# EasyEDA Pro project New Project_2026-09-05_09-11-29.eprj, board PCB1
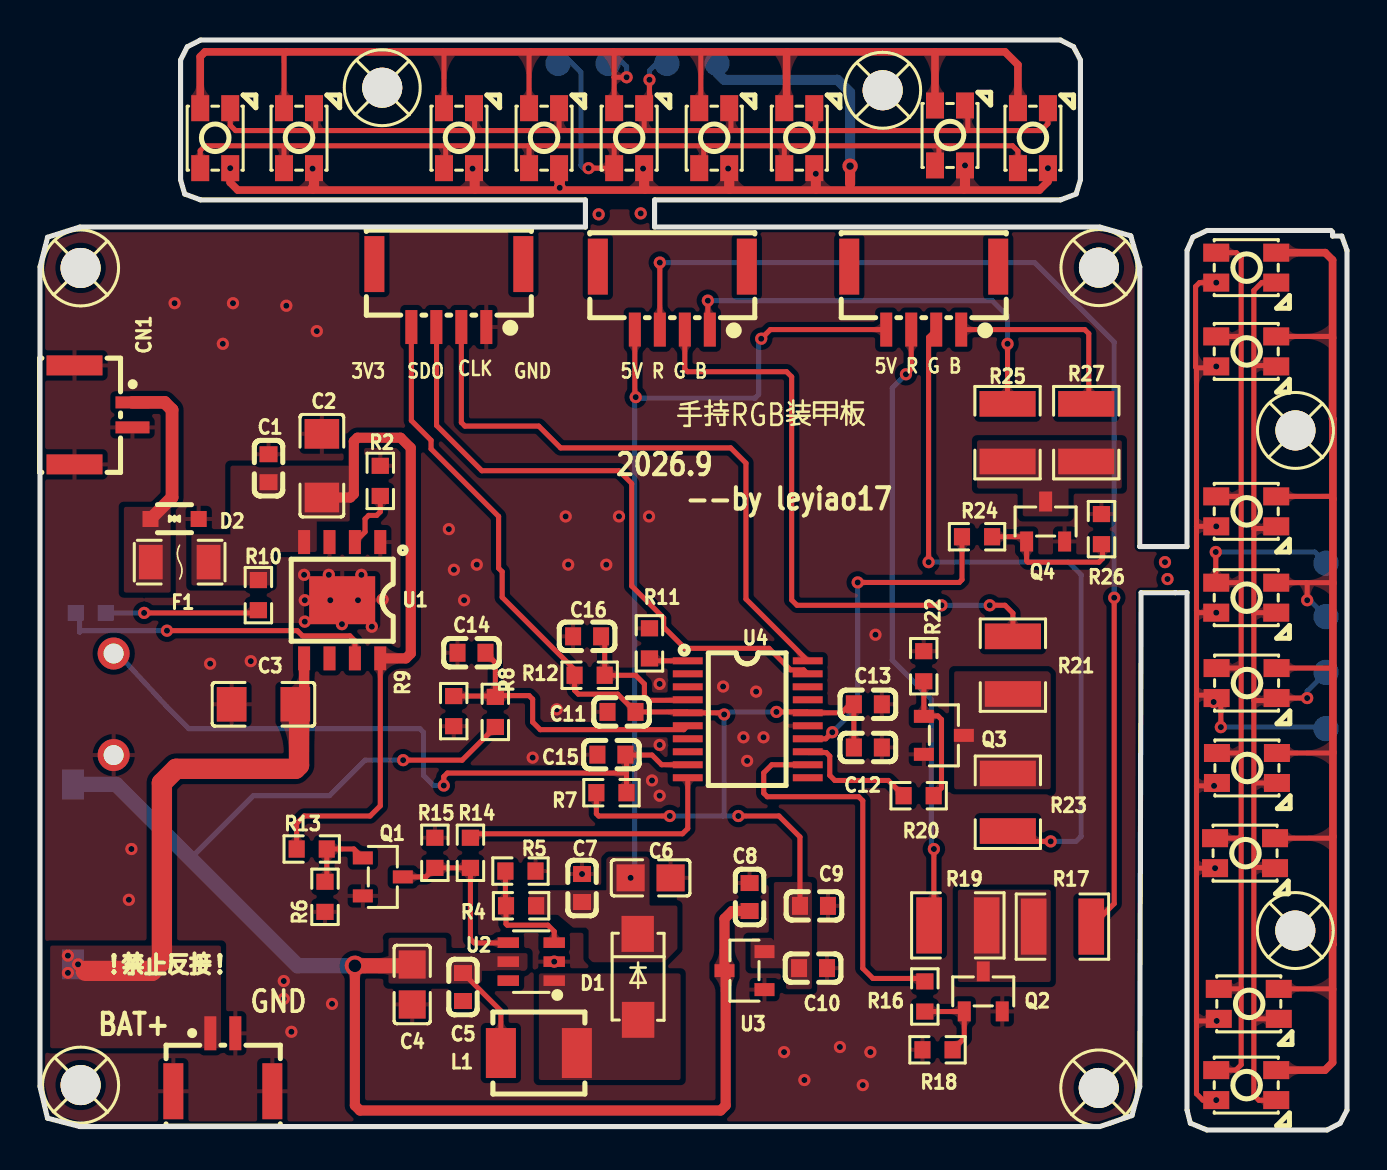
[diagram p4: board, top side]
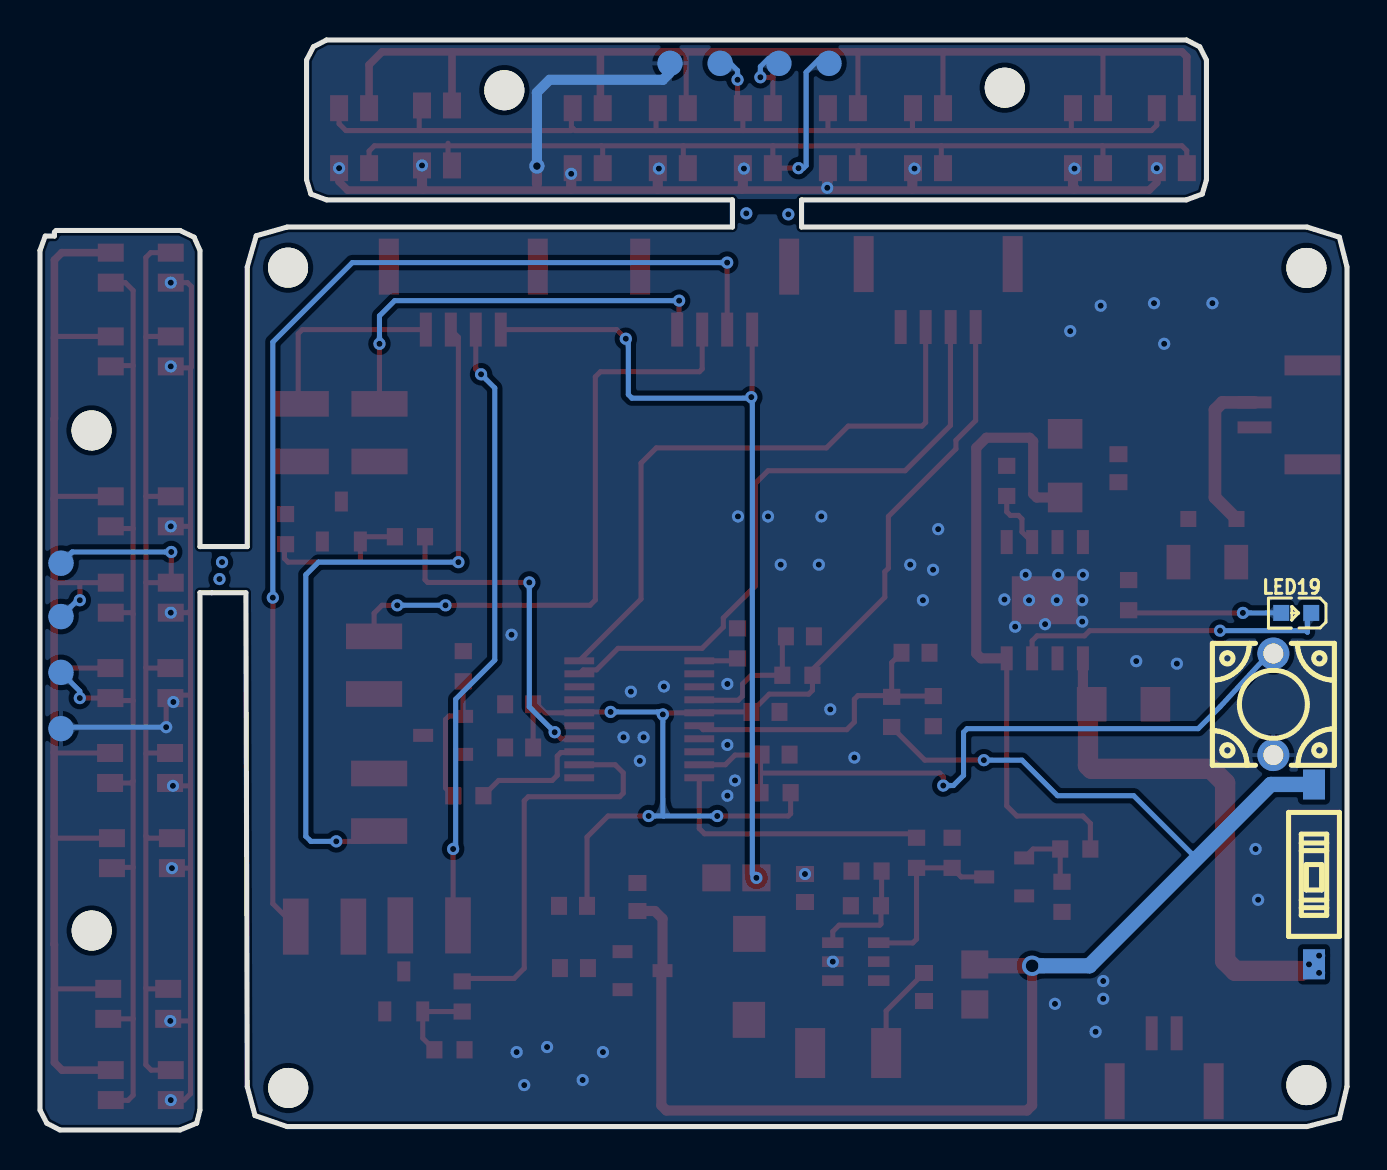
[diagram p5: board, bottom side, seen from below]

Outline 65.36 x 54.53 mm; copper layers: Top Layer, Bottom Layer. Coordinates in mm from the lower left corner of the outline.
Outline path: 0,43.17 0.38,44.67 2,45.17 27.28,45.17 27.28,46.53 8.03,46.53 7.24,46.82 7.03,47.53 7.03,53.53 7.37,54.19 8.03,54.53 51.03,54.53 51.69,54.19 52.03,53.53 52.03,47.53 51.82,46.82 51.03,46.53 30.74,46.53 30.74,45.17 53,45.17 54.55,44.73 55,43.17 55,29.19 57.36,29.19 57.36,44 57.66,44.67 58.36,45 64.56,45 64.64,44.92 64.64,44.72 65.1,44.72 65.36,44 65.36,1 65.02,0.34 64.36,0 58.36,0 57.53,0.34 57.36,1 57.36,26.88 56.77,26.88 55.07,26.88 55,2.17 54.61,0.72 53,0.17 2,0.17 0.38,0.59 0,2.17 0,43.17
Stack: Top Layer 0.035mm / Dielectric1 1.51mm FR4 er 4.5 / Bottom Layer 0.035mm

## Design rules (mm)
template: 自定义配置
spacing copperThickness1oz (default): track to track 0.102, other pairs 0.152 to 0.3
spacing copperThickness2oz: track to track 0.203, other pairs 0.152 to 0.3
track width copperThickness1oz (default): min 0.127, default 0.254, max 2.54
track width copperThickness2oz: min 0.203, default 0.254, max 2.54
differential pair differentialPair (default): width min 0.127, default 0.254, max 2.54; gap min 0.152, default 0.152
via viaSize (default): diameter min 0.5, default 0.61, max 10; hole min 0.3, default 0.305, max 6.3
net USB_5V uses copperRegion1
net BAT+ uses copperRegion1
net +5V uses copperRegion1
net $1N3575 uses copperRegion1
net USB_VBUS uses copperRegion1
net $1N6844 uses copperRegion1
net $1N6957 uses copperRegion1
net $1N6996 uses copperRegion1
net SYS_BAT uses copperRegion1
net 3V3 uses copperRegion1

## Placement (name value [footprint] x y rotation side)
C1  100nF  [C0603]  11.43 33.11 270 top
C2  10uF  [C1206]  14.1 33.23 270 top
C3  10uF  [C1206]  11.18 21.3 0 top
C4  22uF  [C0805]  18.61 7.28 90 top
C5  100nF  [C0603]  21.15 7.15 90 top
C6  22uF  [C0805]  30.54 12.61 180 top
C7  100nF  [C0603]  27.11 12.11 270 top
C8  1uF  [C0603]  35.49 11.66 270 top
C9  1uF  [C0603]  38.71 11.21 180 top
C10  100nF  [C0603]  38.66 8.1 180 top
C11  100nF  [C0603]  29.08 20.92 0 top
C12  100nF  [C0603]  41.4 19.14 180 top
C13  1uF  [C0603]  41.4 21.3 180 top
C14  100nF  [C0603]  21.58 23.88 0 top
C15  100nF  [C0603]  28.58 18.78 0 top
C16  100nF  [C0603]  27.36 24.7 0 top
CN1  WAFER-GH1.25-2PWB  [CONN-TH_2P-P1.25_XUNPU_WAFER-GH1.25-2PWB]  3.17 35.78 270 top
CN2  WAFER-GH1.25-2PWB  [CONN-TH_2P-P1.25_XUNPU_WAFER-GH1.25-2PWB]  9.14 3.39 0 top
D1  SS34  [SMA_L4.3-W2.6-LS5.0-FD]  29.9 7.66 90 top
D2  PESD5V0S1BA,115  [SOD-323_L1.7-W1.3-LS2.5-BI]  6.73 30.57 0 top
F1  BSMD1206-200-6V  [F1206]  6.98 28.41 0 top
L1  4.7uH  [IND-SMD_L4.6-W4.1-A]  24.95 3.85 0 top
LED1  S4-3528RGBTA-A  [LED-SMD_4P-L3.2-W2.8-LS3.5-TL-1]  8.76 49.62 90 top
LED2  S4-3528RGBTA-A  [LED-SMD_4P-L3.2-W2.8-LS3.5-TL-1]  45.51 49.75 90 top
LED3  S4-3528RGBTA-A  [LED-SMD_4P-L3.2-W2.8-LS3.5-TL-1]  12.95 49.62 90 top
LED4  S4-3528RGBTA-A  [LED-SMD_4P-L3.2-W2.8-LS3.5-TL-1]  33.72 49.62 90 top
LED5  S4-3528RGBTA-A  [LED-SMD_4P-L3.2-W2.8-LS3.5-TL-1]  25.21 49.62 90 top
LED6  S4-3528RGBTA-A  [LED-SMD_4P-L3.2-W2.8-LS3.5-TL-1]  20.96 49.62 90 top
LED7  S4-3528RGBTA-A  [LED-SMD_4P-L3.2-W2.8-LS3.5-TL-1]  37.97 49.62 90 top
LED8  S4-3528RGBTA-A  [LED-SMD_4P-L3.2-W2.8-LS3.5-TL-1]  29.46 49.62 90 top
LED9  S4-3528RGBTA-A  [LED-SMD_4P-L3.2-W2.8-LS3.5-TL-1]  49.66 49.62 90 top
LED10  S4-3528RGBTA-A  [LED-SMD_4P-L3.2-W2.8-LS3.5-TL-1]  60.32 2.25 0 top
LED11  S4-3528RGBTA-A  [LED-SMD_4P-L3.2-W2.8-LS3.5-TL-1]  60.45 6.31 0 top
LED12  S4-3528RGBTA-A  [LED-SMD_4P-L3.2-W2.8-LS3.5-TL-1]  60.32 26.63 0 top
LED13  S4-3528RGBTA-A  [LED-SMD_4P-L3.2-W2.8-LS3.5-TL-1]  60.36 18.11 0 top
LED14  S4-3528RGBTA-A  [LED-SMD_4P-L3.2-W2.8-LS3.5-TL-1]  60.32 38.95 0 top
LED15  S4-3528RGBTA-A  [LED-SMD_4P-L3.2-W2.8-LS3.5-TL-1]  60.32 30.95 0 top
LED16  S4-3528RGBTA-A  [LED-SMD_4P-L3.2-W2.8-LS3.5-TL-1]  60.27 13.85 0 top
LED17  S4-3528RGBTA-A  [LED-SMD_4P-L3.2-W2.8-LS3.5-TL-1]  60.34 22.36 0 top
LED18  S4-3528RGBTA-A  [LED-SMD_4P-L3.2-W2.8-LS3.5-TL-1]  60.32 43.14 0 top
LED19  LTST-C190KSKT  [LED0603-RD]  2.54 25.87 0 bottom
Q1  MMBT3904  [SOT-23-3_L2.9-W1.3-P1.90-LS2.4-BR]  17.15 12.66 180 top
Q2  AO3400A  [SOT-23-3_L2.9-W1.3-P1.90-LS2.4-BR]  47.17 6.93 270 top
Q3  AO3400A  [SOT-23-3_L2.9-W1.3-P1.90-LS2.4-BR]  45.2 19.74 180 top
Q4  AO3400A  [SOT-23-3_L2.9-W1.3-P1.90-LS2.4-BR]  50.29 30.44 270 top
R2  4.7kΩ  [R0603]  17.02 32.47 270 top
R4  110kΩ  [R0603]  24.06 11.22 0 top
R5  15kΩ  [R0603]  24.03 12.95 180 top
R6  100kΩ  [R0603]  14.25 11.67 90 top
R7  10K  [R0603]  28.58 16.88 180 top
R8  100kΩ  [R0603]  22.77 20.92 270 top
R9  100kΩ  [R0603]  20.69 20.95 270 top
R10  2.4kΩ  [R0603]  10.92 26.76 90 top
R11  10kΩ  [R0603]  30.48 24.34 270 top
R12  10K  [R0603]  27.49 22.75 180 top
R13  10kΩ  [R0603]  13.59 14.06 0 top
R14  10kΩ  [R0603]  21.53 13.87 270 top
R15  100kΩ  [R0603]  19.75 13.87 270 top
R16  100Ω  [R0603]  44.25 6.68 270 top
R17  68Ω  [R1210]  51.13 10.18 0 top
R18  100kΩ  [R0603]  44.89 4.01 0 top
R19  68Ω  [R1210]  45.9 10.24 180 top
R20  100Ω  [R0603]  43.94 16.73 0 top
R21  47Ω  [R1210]  48.66 23.25 90 top
R22  100kΩ  [R0603]  44.2 23.2 270 top
R23  47Ω  [R1210]  48.4 16.4 270 top
R24  100Ω  [R0603]  46.86 29.68 0 top
R25  47Ω  [R1210]  48.39 34.89 90 top
R26  100kΩ  [R0603]  53.09 30.06 270 top
R27  47Ω  [R1210]  52.32 34.89 90 top
SCREW1  -  [M2螺丝]  62.78 9.98 0 top
SCREW2  -  [M2螺丝]  62.79 35 0 top
SCREW3  -  [M2螺丝]  17.12 52.14 0 top
SCREW4  -  [M2螺丝]  42.14 52.02 0 top
SCREW5  -  [M2螺丝]  52.96 43.14 0 top
SCREW6  -  [M2螺丝]  52.95 2.1 0 top
SCREW7  -  [M2螺丝]  2.03 43.13 0 top
SCREW8  -  [M2螺丝]  2.03 2.25 0 top
SW1  TSX06121-095B333DA-L2000  [SW-TH_L6.1-W6.1-P5.00]  3.68 21.3 90 bottom
SW2  DSIC01LS-P  [SW-SMD_2P-L3.5-W6.1-P2.54-LS9.8]  1.65 12.79 270 bottom
TP1  -  [Test-Point-0.5mm]  25.91 53.36 180 bottom
TP2  -  [Test-Point-0.5mm]  31.35 53.36 180 bottom
TP3  -  [Test-Point-0.5mm]  28.41 53.36 180 bottom
TP4  -  [Test-Point-0.5mm]  33.86 53.36 180 bottom
TP5  -  [Test-Point-0.5mm]  64.32 28.36 90 bottom
TP6  -  [Test-Point-0.5mm]  64.32 22.89 270 bottom
TP7  -  [Test-Point-0.5mm]  64.32 25.68 270 bottom
TP8  -  [Test-Point-0.5mm]  64.32 20.08 270 bottom
U1  TP4056  [ESOP-8_L4.9-W3.9-P1.27-LS6.0-BL-EP]  15.11 26.5 180 top
U2  MT3608  [SOT-23-6_L2.9-W1.6-P0.95-LS2.8-BL]  24.57 8.42 90 top
U3  XC6206P332MR  [SOT-23-3_L2.9-W1.3-P1.90-LS2.4-BR]  35.23 7.97 0 top
U4  STM32F030F4P6TR  [SOP-20_L6.5-W4.4-P0.65-LS6.4-BL]  35.4 20.55 270 top
U5  WAFER-GH1.25-4PWB  [CONN-SMD_4P-P1.25_XUNPU_WAFER-GH1.25-4PWB]  31.62 41.62 180 top
U6  WAFER-GH1.25-4PWB  [CONN-SMD_4P-P1.25_XUNPU_WAFER-GH1.25-4PWB]  44.2 41.62 180 top
U7  WAFER-GH1.25-4PWB  [CONN-SMD_4P-P1.25_XUNPU_WAFER-GH1.25-4PWB]  20.45 41.74 180 top

## Footprints (pads in the part's own frame, mm; a bottom-side part is the same pattern mirrored in y, then rotated)
C0603
  rect 0.8x0.9 smd: 1(-0.7,0) 2(0.7,0)
C0805
  rect 1.41x1.35 smd: 1(-1,0) 2(1,0)
C1206
  rect 1.485x1.728 smd: 1(-1.593,0) 2(1.593,0)
CONN-SMD_4P-P1.25_XUNPU_WAFER-GH1.25-4PWB
  rect 0.6x1.7 smd: 1(-1.875,1.575) 2(-0.625,1.575) 3(0.625,1.575) 4(1.875,1.575)
  rect 1x2.8 smd: 5(3.725,-1.575) 6(-3.725,-1.575)
CONN-TH_2P-P1.25_XUNPU_WAFER-GH1.25-2PWB
  rect 0.6x1.7 smd: 1(-0.625,1.45) 2(0.625,1.45)
  rect 1x2.8 smd: 3(-2.475,-1.45) 4(2.475,-1.45)
ESOP-8_L4.9-W3.9-P1.27-LS6.0-BL-EP
  rect 0.6x1.2 smd: 1(-1.905,-2.909) 2(-0.635,-2.909) 3(0.635,-2.909) 4(1.905,-2.909) 5(1.905,2.909) 6(0.635,2.909) 7(-0.635,2.909) 8(-1.905,2.909)
  rect 3.3x2.4 smd: 9(0,0)
F1206
  rect 1.19x1.728 smd: 1(-1.445,0) 2(1.445,0)
IND-SMD_L4.6-W4.1-A
  rect 1.5x2.5 smd: 1(-1.9,0) 2(1.9,0)
LED0603-RD
  rect 0.8x0.8 smd: 1(-0.749,0) 2(0.749,0)
LED-SMD_4P-L3.2-W2.8-LS3.5-TL-1
  rect 1.3x0.9 smd: 1(-1.5,0.75) 2(-1.5,-0.75) 3(1.5,0.75) 4(1.5,-0.75)
M2螺丝
  round 2 hole 2: 1(0,0)
R0603
  rect 0.806x0.864 smd: 1(-0.753,0) 2(0.753,0)
R1210
  rect 1.282x2.808 smd: 1(-1.441,0) 2(1.441,0)
SMA_L4.3-W2.6-LS5.0-FD
  rect 1.8x1.62 smd: 1(-2.15,-0.009) 2(2.15,0.009)
SOD-323_L1.7-W1.3-LS2.5-BI
  rect 0.8x0.8 smd: 1(-1.205,0) 2(1.205,0)
SOP-20_L6.5-W4.4-P0.65-LS6.4-BL
  rect 0.35x1.494 smd: 1(-2.925,-3.001) 2(-2.275,-3.001) 3(-1.625,-3.001) 4(-0.975,-3.001) 5(-0.325,-3.001) 6(0.324,-3.001) 7(0.975,-3.001) 8(1.625,-3.001) 9(2.275,-3.001) 10(2.925,-3.001) 11(2.925,3.001) 12(2.275,3.001) 13(1.625,3.001) 14(0.975,3.001) 15(0.325,3.001) 16(-0.325,3.001) 17(-0.975,3.001) 18(-1.625,2.996) 19(-2.275,2.996) 20(-2.925,3.001)
SOT-23-3_L2.9-W1.3-P1.90-LS2.4-BR
  rect 1x0.65 smd: 1(1,-0.95) 2(1,0.95) 3(-1,0)
SOT-23-6_L2.9-W1.6-P0.95-LS2.8-BL
  rect 0.532x1.072 smd: 1(-0.95,-1.149) 2(0,-1.149) 3(0.95,-1.149) 4(0.95,1.149) 5(0,1.149) 6(-0.95,1.149)
SW-SMD_2P-L3.5-W6.1-P2.54-LS9.8
  rect 1.5x1.1 smd: 1(-4.5,0) 2(4.5,0)
SW-TH_L6.1-W6.1-P5.00
  round 1.6 hole 1: 1(-2.54,0) 2(2.54,0)
Test-Point-0.5mm
  round 1.27 smd: 1(0,0)

## Nets
As in the schematic.

Pads without a net: C5 1; SCREW1 1; SCREW2 1; SCREW3 1; SCREW4 1; SCREW5 1; SCREW6 1; SCREW7 1; SCREW8 1; U2 6; U4 2 3 7 8 11 17 18; U5 5 6; U6 5 6; U7 5 6

## Via types
v1: diameter 0.61, hole 0.305, Top Layer to Bottom Layer, 106 vias
v2: diameter 1.016, hole 0.635, Top Layer to Bottom Layer, 1 via
v3: diameter 0.762, hole 0.381, Top Layer to Bottom Layer, 1 via

## Routing (per net, layer and track width the routed paths; a pad name or vN(x,y) marks a point on that pad's centre or on a via; arc(x,y) is an arc through that point)
3V3: length 58.5
  Top Layer w0.254: C9.2 38.01,14.66 36.96,15.71 v1(34.93,15.71) ; v1(34.22,20.79) 34.22,20.81 34.16,20.87 U4.5 32.35,20.92 C11.2 28.89,21.81 26.92,21.81 26.73,22 26.73,22.5 ; U7.4 18.57,35.49 19.56,34.5 19.56,34.07 22.94,30.69 22.94,28.11 23.11,27.93 23.11,26.65 26.73,23.03 R12.2 ; v1(36.83,20.92) 38.35,20.92 U4.16 40.09,20.87 40.51,21.3 C13.2 C12.2 ; R7.2 27.82,15.82 27.94,15.71 v1(31.5,15.71)
  Bottom Layer w0.254: v1(31.5,15.71) 34.16,15.71 ; 34.16,15.71 v1(34.93,15.71) ; 34.16,15.71 34.22,15.76 v1(34.22,20.79) 34.34,20.92 v1(36.83,20.92)
+5V: length 43.2
  Top Layer w0.254: v1(36.07,39.59) 36.53,40.04 U6.4 ; v1(29.79,36.66) 29.75,36.71 U5.4
  Bottom Layer w0.254: 29.74,36.61 35.76,36.61 35.94,36.79 35.94,39.46 v1(36.07,39.59) ; 29.74,36.61 29.72,36.61 29.77,36.66 v1(29.79,36.66) 29.74,36.61 ; 29.74,36.61 29.74,12.82 v1(29.54,12.61)
GND:
  vias: v1(4.44,11.52) v1(4.57,14.06) v1(6.73,41.36) v1(8.51,23.33) v1(9.14,39.33) v1(9.65,41.36) v1(10.54,23.46) v1(12.19,7.45) v1(12.19,6.56) v1(12.32,41.24) v1(12.57,4.91) v1(13.21,27.77) v1(13.24,26.5) v1(13.24,25.43) v1(13.84,39.97) v1(14.44,27.77) v1(14.52,26.5) v1(14.6,6.31) v1(15.1,25.31) v1(15.9,26.5) v1(16.07,27.77) v1(16.6,25.18) v1(17.13,26.54) v1(20.45,30.06) v1(20.7,28.03) v1(21.21,26.5) v1(21.84,28.28) v1(24.64,18.63) v1(25.72,8.42) v1(25.84,21.04) v1(26.29,30.7) v1(26.42,28.28) v1(27.11,12.81) v1(28.32,28.28) v1(28.96,30.7) v1(30.46,30.7) v1(30.61,17.49) v1(30.99,22.32) v1(30.99,19.27) v1(30.99,16.73) v1(34.16,22.19) v1(35.18,19.65) v1(35.36,18.47) v1(35.81,21.93) v1(36.18,19.65) v1(37.21,3.9) v1(38.23,2.5) v1(40,4.15) v1(41.15,2.25) v1(41.53,3.9) v1(41.78,24.78)
(no net):
  vias: v1(27.94,45.81) v1(30.04,45.86) v1(56.26,28.41) v1(56.39,27.56)
B1: length 59.1
  Top Layer w0.254: 60.07,39.67 60.04,39.7 LED14.1 ; 60.07,39.67 60.07,31.71 ; 60.07,39.67 60.07,43.65 59.83,43.89 LED18.1 ; 60.07,31.71 60.07,27.39 ; 60.07,31.71 60.06,31.7 LED15.1 ; 60.07,27.39 60.07,23.14 ; 60.07,27.39 60.06,27.38 LED12.1 58.8,27.41 v1(58.8,28.92) ; 60.07,7.1 60.03,7.06 LED11.1 ; 60.07,7.1 60.07,14.72 ; 60.07,7.1 60.07,3.26 59.81,3 LED10.1 ; 60.07,18.83 60.07,14.72 ; 60.07,18.83 60.07,23.14 ; 60.07,18.83 60.04,18.86 LED13.1 ; 60.07,14.72 59.96,14.6 LED16.1 ; LED17.1 60.04,23.11 60.07,23.14
  Bottom Layer w0.254: v1(58.8,28.92) 63.75,28.92 TP5.1
B2: length 58.7
  Top Layer w0.254: LED3.1 12.2,49.2 12.24,49.24 ; 44.76,48.25 44.96,48.45 44.96,49.24 ; 33.19,49.24 33.19,48.34 LED4.1 ; 33.19,49.24 28.7,49.24 ; 33.19,49.24 37.29,49.24 ; LED6.1 20.29,48.2 20.29,49.24 ; 12.24,49.24 8.25,49.24 8.01,49 LED1.1 ; 12.24,49.24 20.29,49.24 ; 44.96,49.24 44.96,49.36 ; 44.96,49.24 48.64,49.24 48.91,48.97 LED9.1 ; 44.96,49.24 37.29,49.24 ; 24.43,49.24 28.7,49.24 ; 24.43,49.24 24.46,49.21 LED5.1 ; 24.43,49.24 20.29,49.24 ; 28.7,49.24 28.71,49.23 LED8.1 v1(27.43,48.12) ; LED7.1 37.22,49.17 37.29,49.24
  Bottom Layer w0.254: 25.91,53.56 26.42,53.56 27.05,52.92 27.05,48.25 27.18,48.12 v1(27.43,48.12)
B_A: length 21.2
  Top Layer w0.254: U5.1 33.4,40.14 v1(33.4,41.49) ; R25.2 v1(48.39,39.33)
  Bottom Layer w0.254: v1(33.4,41.49) 47.62,41.49 48.39,40.73 v1(48.39,39.33)
B_B: length 10
  Top Layer w0.254: R27.2 52.45,36.45 52.45,39.84 52.25,40.04 U6.1
BAT+: length 25.7
  Top Layer w0.508: C3.2 13.21,21.74 U1.5
  Top Layer w1.016: 2.29,7.96 5.59,7.96 6.1,8.47 6.1,17.36 6.81,18.07 12.77,18.07 12.95,18.25 12.95,21.11 C3.2
  vias: v1(1.4,8.72) v1(1.4,7.86) v1(1.9,8.29)
BAT_ADC: length 15.6
  Top Layer w0.254: R9.1 22.73,21.71 R8.1 ; R8.1 22.77,23.38 C14.2 ; R8.1 22.83,21.73 24.46,21.73 24.64,21.55 24.64,20.41 25.02,20.03 32.2,20.03 U4.6
BLUE_PWM: length 16.8
  Top Layer w0.254: U4.14 39.3,19.57 v1(39.62,19.9) ; R24.1 46.11,27.53 45.97,27.39 v1(40.89,27.39)
  Bottom Layer w0.254: v1(39.62,19.9) 40.89,21.17 v1(40.89,27.39)
BOOST_CMD: length 13.6
  Top Layer w0.254: R14.1 21.73,14.82 32.13,14.82 32.39,15.08 U4.10
BOOST_EN: length 9.1
  Top Layer w0.254: Q1.3 19.3,12.66 R15.2 R14.2 21.53,9.55 21.72,9.36 23.4,9.36 U2.4
CHRG_N: length 15.9
  Top Layer w0.254: v1(6.35,24.98) 12.87,24.98 13.13,24.72 15.5,24.72 15.75,24.47 U1.7
  Bottom Layer w0.254: LED19.1 1.98,25.68 1.98,24.91 2.05,24.98 v1(6.35,24.98)
COM2+: length 62.5
  Top Layer w0.381: v1(50.41,48.12) 50.41,47.45 49.98,47.02 9.89,47.02 9.51,47.4 v1(9.51,48.12)
  Top Layer w0.508: LED5.2 25.99,48.09 25.99,47.47 ; LED8.2 30.21,47.14 30.27,47.08 ; v1(46.26,48.25) 46.26,47.14 46.21,47.08 ; LED4.2 34.47,47.1 34.48,47.08 ; LED3.2 13.7,47.19 13.66,47.15 13.66,47.08 ; 38.8,47.08 38.8,48.04 LED7.2 ; 21.74,47.08 21.74,48.08 LED6.2 ; 25.99,47.47 25.96,47.5 ; 25.99,47.47 v1(25.99,47.14) ; v3(40.51,48.22) 40.51,47.33
  Bottom Layer w0.508: v3(40.51,48.22) 40.51,51.9 39.88,52.54 34.22,52.54 33.91,52.84 33.91,53.69
  vias: v1(13.63,48.1) v1(21.63,48.1) v1(30.16,48.1) v1(34.41,48.1) v1(38.8,47.84)
COM+: length 56.8
  Top Layer w0.254: v1(58.82,1.5) 58.15,1.5 57.84,1.81 57.84,5.46 ; v1(58.82,42.39) 57.99,42.39 57.79,42.19 57.79,38.17 57.84,38.13 ; v1(58.82,38.2) 58.75,38.13 57.84,38.13 ; 57.84,30.19 57.85,30.2 v1(58.82,30.2) ; 57.84,30.19 57.84,38.13 ; 57.84,30.19 57.84,25.99 ; 57.84,13.11 57.84,5.46 ; 57.84,13.11 57.85,13.1 v1(58.77,13.1) ; 57.84,13.11 57.84,17.22 ; 57.84,5.46 v1(58.85,5.46) LED11.2 ; 57.84,25.99 57.95,25.88 v1(58.82,25.88) ; 57.84,25.99 57.84,21.76 ; 57.84,21.76 57.84,17.22 ; 57.84,21.76 58.7,21.76 LED17.2 59.06,21.4 v1(59.06,20.15) ; 57.84,17.22 v1(58.72,17.22) LED13.2
  Bottom Layer w0.254: TP8.1 64.24,20.15 v1(59.06,20.15)
  vias: v1(58.7,21.41)
G1: length 68.2
  Top Layer w0.254: v1(63.37,26.5) 63.37,27.34 63.33,27.38 ; LED12.3 63.33,27.38 ; 63.33,27.38 64.64,27.38 64.66,27.36 ; 64.66,31.57 64.53,31.7 LED15.3 ; 64.66,18.88 64.64,18.86 LED13.3 ; LED16.3 64.58,14.6 64.66,14.68 ; 64.66,23.23 64.54,23.11 LED17.3 ; LED11.3 64.63,7.06 64.64,7.05 ; 64.64,39.64 64.58,39.7 LED14.3
  Top Layer w0.381: LED10.3 64.26,3 64.64,3.38 64.64,9.28 64.66,9.29 64.66,35.56 64.64,35.58 64.64,43.52 64.27,43.89 LED18.3
  Bottom Layer w0.254: TP7.1 63.5,26.5 v1(63.37,26.5)
G2: length 67.5
  Top Layer w0.254: 24.52,53.94 24.46,53.88 LED5.3 ; 28.71,52.66 28.71,53.88 28.66,53.94 ; 28.71,52.66 28.72,52.67 v1(29.34,52.67) ; 28.71,52.66 LED8.3 ; 20.16,53.94 20.21,53.89 LED6.3 ; 12.31,53.94 12.2,53.83 LED3.3 ; 33.05,53.94 33.05,51.2 LED4.3
  Top Layer w0.381: 44.76,53.94 37.34,53.94 ; 44.76,53.94 44.76,51.25 ; 44.76,53.94 48.26,53.94 48.91,53.29 LED9.3 ; 37.34,53.94 37.34,51.23 LED7.3 ; 37.34,53.94 8.25,53.94 8.01,53.69 LED1.3
  Bottom Layer w0.254: v1(29.34,52.67) 29.34,53.2 28.92,53.61
G_A: length 31.1
  Top Layer w0.254: U5.2 32.25,38.07 32.38,37.93 37.34,37.93 37.59,37.68 37.59,26.52 37.86,26.25 v1(45.09,26.25) ; R21.2 48.66,25.85 48.26,26.25 v1(47.5,26.25)
  Bottom Layer w0.254: v1(47.5,26.25) v1(45.09,26.25)
G_B: length 36.8
  Top Layer w0.254: 48.4,14.96 48.92,14.44 v1(50.55,14.44) ; U6.2 44.44,39.66 v1(44.44,28.41)
  Bottom Layer w0.254: v1(50.55,14.44) 51.82,14.44 52.07,14.69 52.07,27.77 51.44,28.41 v1(44.44,28.41)
GREEN_PWM: length 6.3
  Top Layer w0.254: R20.1 42.43,17.49 39.75,17.49 39.5,17.74 39.5,18.7 39.32,18.88 38.44,18.88 U4.13
KEY: length 35.2
  Top Layer w0.254: 29.33,17.86 R7.1 ; 29.33,17.86 20.37,17.86 20.19,17.68 v1(20.19,17.23) ; 29.33,17.86 29.33,18.73 29.3,18.76 ; 29.3,18.76 30.61,18.76 31.09,18.27 U4.9 ; 29.3,18.76 C15.2
  Bottom Layer w0.254: 3.89,23.84 6.35,21.17 7.44,20.08 19,20.08 19.18,19.9 19.18,17.74 19.69,17.23 v1(20.19,17.23)
NRST: length 7.1
  Top Layer w0.254: C16.2 28.24,24.52 R12.1 29.79,22.75 30.23,22.31 30.23,21.72 30.44,21.5 32.37,21.5 U4.4
R1: length 54.1
  Top Layer w0.254: LED14.4 61.78,38.24 60.71,38.24 ; 60.71,38.24 60.71,42 61.1,42.39 LED18.4 ; 60.71,38.24 60.71,30.09 ; 60.71,25.81 60.71,21.48 ; 60.71,25.81 60.71,30.09 ; 60.71,25.81 60.78,25.88 LED12.4 ; 60.71,21.48 60.71,17.46 ; 60.71,21.48 61.72,21.48 LED17.4 v1(63.37,21.61) ; 60.71,5.56 60.71,5.56 LED11.4 ; 60.71,5.56 60.71,13.14 ; 60.71,5.56 60.71,1.74 60.96,1.49 61.81,1.49 LED10.4 ; 60.71,30.09 61.72,30.09 LED15.4 ; 60.71,17.46 60.71,13.14 ; 60.71,17.46 60.81,17.36 LED13.4 ; LED16.4 61.73,13.14 60.71,13.14
  Bottom Layer w0.254: TP6.1 63.37,21.95 v1(63.37,21.61)
R2: length 53.8
  Top Layer w0.254: 25.98,50 30.21,50 ; 25.98,50 21.73,50 ; 25.98,50 25.96,50.02 LED5.4 ; 30.21,50 30.21,50 LED8.4 30.48,51.38 v1(30.48,52.54) ; 30.21,50 34.56,50 ; LED3.4 13.79,51.03 13.79,50 ; 21.73,50 21.73,51.09 LED6.4 ; 21.73,50 13.79,50 ; LED4.4 34.56,51.03 34.56,50 ; 13.79,50 9.78,50 9.51,50.27 LED1.4 ; 46.4,50 38.81,50 38.71,50.1 ; 46.4,50 46.4,51.12 46.26,51.25 ; 46.4,50 50.07,50 50.41,50.34 LED9.4 ; 38.71,50.1 38.79,50.1 38.79,51.05 LED7.4 ; 38.71,50.1 38.61,50 34.56,50
  Bottom Layer w0.254: v1(30.48,52.54) 30.48,53 31.09,53.61
R_A: length 57.4
  Top Layer w0.254: U5.3 v1(31,43.39) ; R17.2 53.72,11.32 v1(53.72,26.63)
  Bottom Layer w0.254: v1(53.72,26.63) 53.72,39.42 49.74,43.39 v1(31,43.39)
R_B: length 31.2
  Top Layer w0.254: v1(43.31,37.81) 43.57,38.07 U6.3 ; v1(44.7,14.06) 44.7,10.48 R19.2
  Bottom Layer w0.254: v1(44.7,14.06) 44.58,14.19 44.58,21.55 42.62,23.51 42.62,37.12 v1(43.31,37.81)
RED_PWM: length 20.3
  Top Layer w0.254: R16.1 44.1,7.58 41.66,7.58 41.15,8.09 41.15,16.47 40.95,16.67 36.37,16.67 36.19,16.85 36.19,17.87 36.6,18.27 U4.12
SWCLK: length 31
  Top Layer w0.254: U7.2 21.07,35.39 21.25,35.21 24.94,35.21 26.03,34.12 34.54,34.12 35.31,33.36 35.31,26.56 U4.20
SWDIO: length 31.5
  Top Layer w0.254: 19.83,39.76 19.83,35.25 22.1,32.98 28.96,32.98 29.59,32.35 29.59,27.22 31.19,25.62 31.19,25.16 32.25,24.1 36.46,24.1 37.53,23.02 38.19,23.02 38.39,22.82
SYS_BAT: length 79.8
  Top Layer w0.254: L1.1 23.05,5.96 C5.2 ; R8.2 21.11,18.5 v1(18.16,18.5)
  Top Layer w0.508: C8.2 34.62,10.96 34.23,10.57 U3.3 34.29,7.91 34.29,1.23 34.04,0.98 16,0.98 15.75,1.23 v2(15.75,8.22)
  Top Layer w0.762: C4.2 18.55,8.22 v2(15.75,8.22)
  Bottom Layer w0.254: v1(18.16,18.5) 16.26,18.5 14.48,16.73 10.67,16.73 7.75,13.8 7.62,13.8
  Bottom Layer w0.762: v2(15.75,8.22) 12.88,8.22 3.81,17.29 SW2.1
USB_5V: length 32.6
  Top Layer w0.254: R13.1 12.84,15.32 12.83,15.33 13.21,15.71 16.51,15.71 17.02,16.22 U1.8
  Top Layer w0.508: C2.2 15.52,31.64 15.7,31.82 15.7,34.45 15.88,34.63 18.03,34.63 18.54,34.12 18.54,23.84 18.3,23.6 U1.8
USB_VBUS: length 8
  Top Layer w0.635: D2.1 6.6,31.65 6.6,36.03 6.23,36.4 CN1.1
$1N2880: length 3.1
  Top Layer w0.254: R2.2 17.02,30.93 16.84,30.75 16.44,30.75 16.26,30.57 16.26,29.92 U1.2
$1N3784: length 5.8
  Top Layer w0.254: R5.2 23.28,11.25 R4.1 23.31,10.31 23.37,10.25 25.4,10.25 25.72,9.93 U2.3
$1N5380: length 4.1
  Top Layer w0.254: R16.2 46.22,5.93 Q2.1 46.22,4.6 R18.2
$1N5670: length 6.7
  Top Layer w0.254: R20.2 45.09,17.11 45.09,20.53 44.91,20.71 44.22,20.71 Q3.1 44.2,22.44 R22.2
$1N5839: length 7.4
  Top Layer w0.254: R26.2 53.14,29.25 53.14,28.59 52.96,28.41 49.4,28.41 49.34,28.47 Q4.1 49.1,29.68 R24.2
$1N10532: length 2
  Top Layer w0.254: U4.1 30.6,23.47 R11.2
$1N13539: length 3.7
  Top Layer w0.254: Q1.1 15.7,14.06 R13.2 14.34,12.51 R6.2
$1N17698: length 7.7
  Top Layer w0.254: R10.1 10.79,25.87 v1(5.21,25.87)
  Bottom Layer w0.254: v1(5.21,25.87) LED19.2

## Copper pours and planes (outline as drawn; the poured copper is in the pictures)
3V3 on Top Layer: 36.58,12.41 38.61,12.41 38.61,7.05 37.31,7.05 37.31,7.86 37.08,8.09 35.54,8.09 35.54,9.51 35.43,9.61 36.58,9.61 36.7,9.49 36.7,12.28
+5V on Top Layer: 28.29,11.99 28.32,12.03 28.32,13.55 28.45,13.68 30.35,13.68 30.48,13.55 30.48,11.28 30.54,11.23 31.88,11.23 31.88,9.06 31.21,8.4 27.63,8.4 27.43,8.6 27.43,9.99 27.31,10.12 26.67,10.12 25.91,10.76 25.79,10.77 24.45,10.77 24.45,11.99
GND on Top Layer: -1.52,46.06 57.28,46.06 57.28,-0.8 -1.52,-0.8
GND on Bottom Layer: -1.91,45.81 56.64,45.81 56.64,-0.55 -1.91,-0.55
BAT+ on Top Layer: 0.51,9.23 9.05,9.23 9.05,4.09 0.51,4.09
COM2+ on Bottom Layer: 5.46,55.59 54.61,55.59 54.61,46.57 5.46,46.57
COM+ on Bottom Layer: 56.77,45.68 66.17,45.68 66.17,-0.67 56.77,-0.67
SYS_BAT on Top Layer: 20.32,9.61 20.32,8.85 24.38,8.85 24.38,8.09 24.26,7.96 22.1,7.96 22.1,7.45 21.97,7.33 17.43,7.33 17.43,9.59 17.4,9.61
USB_5V on Top Layer: 9.53,33.23 15.49,33.23 15.49,30.44 13.84,30.44 13.84,28.92 11.68,28.92 11.58,28.82 11.58,27.24 7.57,27.24 7.57,29.81 9.53,29.81
USB_VBUS on Top Layer: 6.53,31.18 6.53,26.89 4.19,26.89 4.19,31.18
$1N3575 on Top Layer: 32.04,7.84 32.04,2.5 24.95,2.5 24.95,7.84
$1N6844 on Top Layer: 45.9,12.03 45.9,7.41 50.55,7.41 50.55,12.03
$1N6957 on Top Layer: 45.72,22.95 45.72,17.05 50.47,17.05 50.55,16.98 50.55,22.82 50.42,22.95
$1N6996 on Top Layer: 46.86,34.5 54.1,34.5 54.1,32.09 51.44,32.09 51.44,30.7 49.15,30.7 49.15,32.09 46.86,32.09

Small or netless copper shapes (teardrops, artwork), in the pictures only: 274 on Top Layer, 42 on Bottom Layer

## Text on the board
Top Silkscreen Layer: 3V3 | SDO | CLK | GND | 5V R G B | BAT+ | 2026.9 / --by leyiao17 | 手持RGB装甲板 | ！禁止反接！
